# Altium schematic sheet Input_stages.SchDoc
size A4
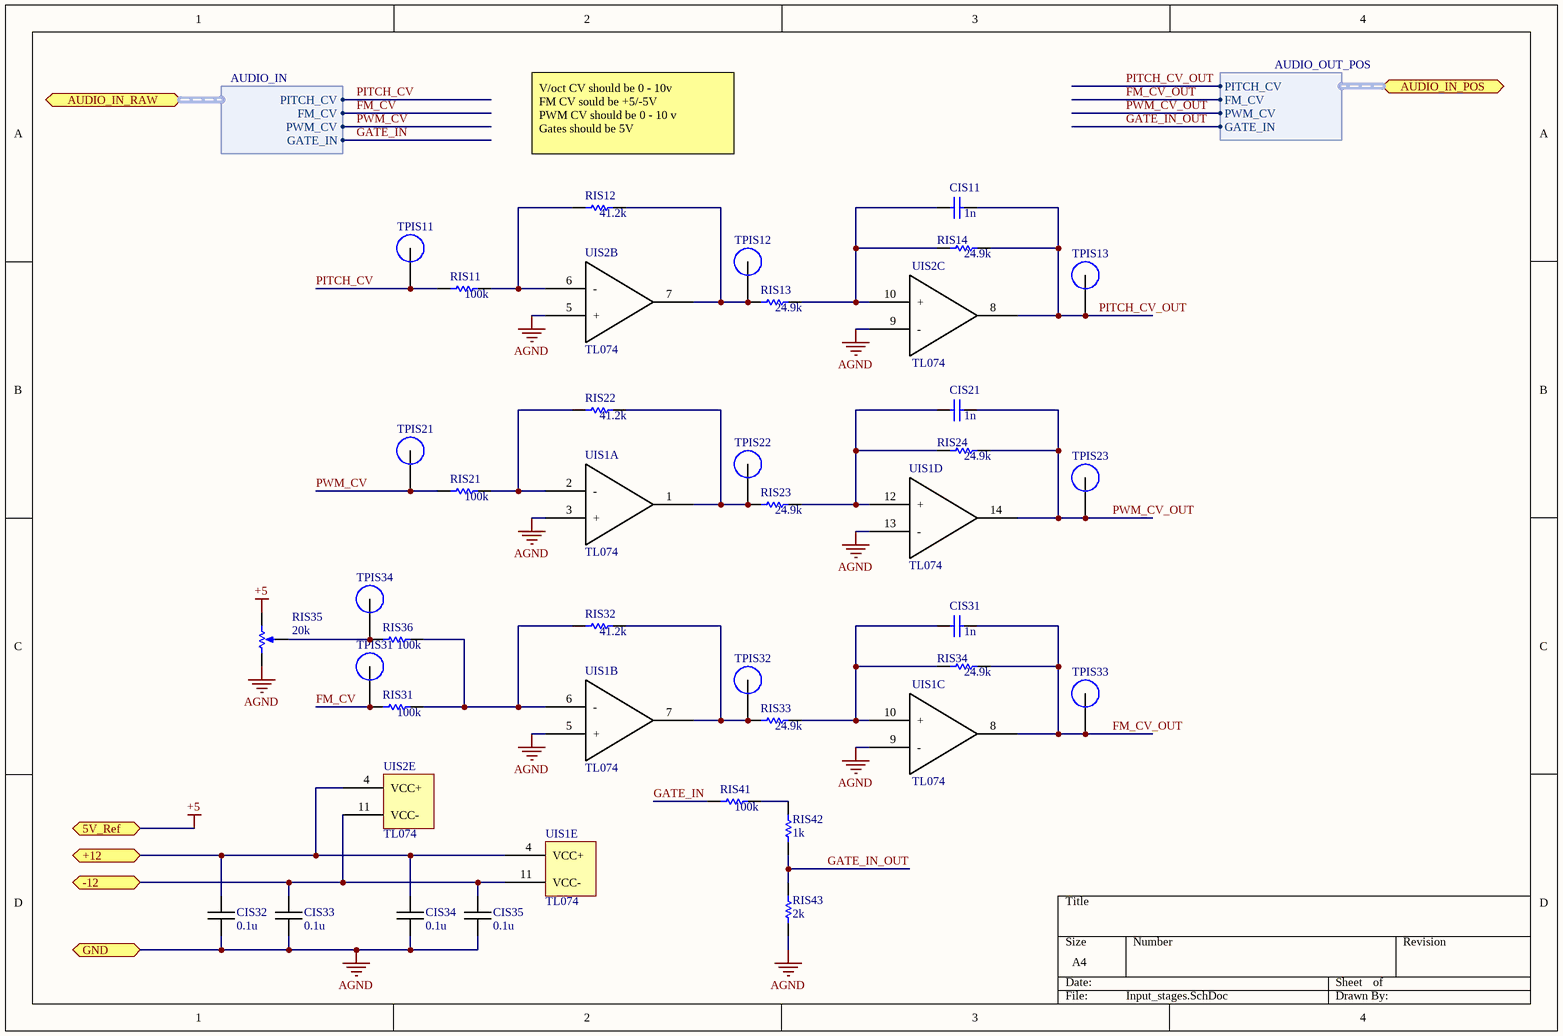
[diagram p0: Input_stages.SchDoc]

## Parts
CIS11  value 1n  [C 0603 / 1608]  (hidden comment: Cap)
CIS21  value 1n  [C 0603 / 1608]  (hidden comment: Cap)
CIS31  value 1n  [C 0603 / 1608]  (hidden comment: Cap)
CIS32  0.1u  [C 0603 / 1608]
CIS33  0.1u  [C 0603 / 1608]
CIS34  0.1u  [C 0603 / 1608]
CIS35  0.1u  [C 0603 / 1608]
RIS11  value 100k  [RES0603R]  (hidden comment: Res1)
RIS12  value 41.2k  [RES0603R]  (hidden comment: Res1)
RIS13  value 24.9k  [RES0603R]  (hidden comment: Res1)
RIS14  value 24.9k  [RES0603R]  (hidden comment: Res1)
RIS21  value 100k  [RES0603R]  (hidden comment: Res1)
RIS22  value 41.2k  [RES0603R]  (hidden comment: Res1)
RIS23  value 24.9k  [RES0603R]  (hidden comment: Res1)
RIS24  value 24.9k  [RES0603R]  (hidden comment: Res1)
RIS31  value 100k  [RES0603R]  (hidden comment: Res1)
RIS32  value 41.2k  [RES0603R]  (hidden comment: Res1)
RIS33  value 24.9k  [RES0603R]  (hidden comment: Res1)
RIS34  value 24.9k  [RES0603R]  (hidden comment: Res1)
RIS35  value 20k  [SMD_POT_3x3mm]
RIS36  value 100k  [RES0603R]  (hidden comment: Res1)
RIS41  value 100k  [RES0603R]  (hidden comment: Res1)
RIS42  value 1k  [RES0603R]  (hidden comment: Res1)
RIS43  value 2k  [RES0603R]  (hidden comment: Res1)
TPIS11  Test Point  [Test POint]  (value not drawn)
TPIS12  Test Point  [Test POint]  (value not drawn)
TPIS13  Test Point  [Test POint]  (value not drawn)
TPIS21  Test Point  [Test POint]  (value not drawn)
TPIS22  Test Point  [Test POint]  (value not drawn)
TPIS23  Test Point  [Test POint]  (value not drawn)
TPIS31  Test Point  [Test POint]  (value not drawn)
TPIS32  Test Point  [Test POint]  (value not drawn)
TPIS33  Test Point  [Test POint]  (value not drawn)
TPIS34  Test Point  [Test POint]  (value not drawn)
UIS1  TL074  [SOIC-14]  (parts A,B,C,D,E of 5)
UIS2  TL074  [SOIC-14]  (parts B,C,E of 5)

## Ports
5V_Ref (bidir), +12 (bidir), -12 (bidir), AUDIO_IN_POS (bidir, harness AUDIO_OUT_POS), AUDIO_IN_RAW (bidir, harness AUDIO_IN), GND (bidir)

## Harnesses
AUDIO_IN: PITCH_CV, FM_CV, PWM_CV, GATE_IN
AUDIO_OUT_POS: PITCH_CV, FM_CV, PWM_CV, GATE_IN

## Nets
+5: RIS35.2(BOT) ; port 5V_Ref
AGND: CIS32.1 CIS33.1 CIS34.1 CIS35.1 RIS35.1(TOP) RIS43.1 UIS1.3(+) UIS1.5(+) UIS1.9(-) UIS1.13(-) UIS2.5(+) UIS2.9(-) ; port GND
+12: CIS32.2 CIS34.2 UIS1.4(VCC+) UIS2.4(VCC+) ; port +12
-12: CIS33.2 CIS35.2 UIS1.11(VCC-) UIS2.11(VCC-) ; port -12
FM_CV: RIS31.1 TPIS31.1 ; port AUDIO_IN_RAW.FM_CV
FM_CV_OUT: CIS31.2 RIS34.2 TPIS33.1 UIS1.8(OUT) ; port AUDIO_IN_POS.FM_CV
GATE_IN: RIS41.1 ; port AUDIO_IN_RAW.GATE_IN
GATE_IN_OUT: RIS42.1 RIS43.2 ; port AUDIO_IN_POS.GATE_IN
PITCH_CV: RIS11.1 TPIS11.1 ; port AUDIO_IN_RAW.PITCH_CV
PITCH_CV_OUT: CIS11.2 RIS14.2 TPIS13.1 UIS2.8(OUT) ; port AUDIO_IN_POS.PITCH_CV
PWM_CV: RIS21.1 TPIS21.1 ; port AUDIO_IN_RAW.PWM_CV
PWM_CV_OUT: CIS21.2 RIS24.2 TPIS23.1 UIS1.14(OUT) ; port AUDIO_IN_POS.PWM_CV
NetCIS11_1: CIS11.1 RIS13.2 RIS14.1 UIS2.10(+)
NetCIS21_1: CIS21.1 RIS23.2 RIS24.1 UIS1.12(+)
NetCIS31_1: CIS31.1 RIS33.2 RIS34.1 UIS1.10(+)
NetRIS11_2: RIS11.2 RIS12.1 UIS2.6(-)
NetRIS12_2: RIS12.2 RIS13.1 TPIS12.1 UIS2.7(OUT)
NetRIS21_2: RIS21.2 RIS22.1 UIS1.2(-)
NetRIS22_2: RIS22.2 RIS23.1 TPIS22.1 UIS1.1(OUT)
NetRIS31_2: RIS31.2 RIS32.1 RIS36.2 UIS1.6(-)
NetRIS32_2: RIS32.2 RIS33.1 TPIS32.1 UIS1.7(OUT)
NetRIS35_3: RIS35.3(TAP) RIS36.1 TPIS34.1
NetRIS41_2: RIS41.2 RIS42.2

## Notes on the sheet
- V/oct CV should be 0 - 10v
  FM CV sould be +5/-5V
  PWM CV should be 0 - 10 v
  Gates should be 5V

## Library data of the parts
CIS11 CIS21 CIS31 = Cap: Capacitor; Published: 8-Jun-2000; LatestRevisionDate: 17-Jul-2002; LatestRevisionNote: Re-released for DXP Platform.; PackageReference: RAD-0.3; Publisher: Altium Limited; PackageDescription: Radial Cap, Thru-Hole; 2 Leads; 0.3 in Pin Spacing
CIS32-CIS35 = Capacitor: Value: 0.1u
RIS11-RIS14 RIS21-RIS24 RIS31-RIS34 RIS36 RIS41-RIS43 = Res1: Resistor; Published: 8-Jun-2000; LatestRevisionDate: 17-Jul-2002; LatestRevisionNote: Re-released for DXP Platform.; PackageReference: AXIAL-0.3; Publisher: Altium Limited; PackageDescription: Axial Device, Thru-Hole; 2 Leads; 0.3 in Pin Spacing
RIS35 = RPot: Potentiometer; Sim Note: Enter the Resistance value and the set point into parameter fields.; Set Position: 0.5; Published: 8-Jun-2000; LatestRevisionDate: 17-Jul-2002; LatestRevisionNote: Re-released for DXP Platform.; PackageReference: VR5; Publisher: Altium Limited; PackageDescription: Variable Resistor, Thru-Hole; 3 Leads